# EAGLE design test_platform (EAGLE 6.5.0)
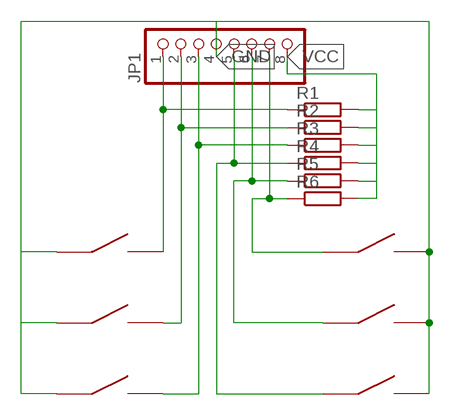
[diagram p0: schematic, sheet 1]

## Parts
JP1  PINHD-1X8BIG  [1X08-BIG]
R1  R-EU_M0805  [M0805]
R2  R-EU_M0805  [M0805]
R3  R-EU_M0805  [M0805]
R4  R-EU_M0805  [M0805]
R5  R-EU_M0805  [M0805]
R6  R-EU_M0805  [M0805]
U$1  SMT_BUTTON  [SMT-BUTTON]
U$2  SMT_BUTTON  [SMT-BUTTON]
U$3  SMT_BUTTON  [SMT-BUTTON]
U$4  SMT_BUTTON  [SMT-BUTTON]
U$5  SMT_BUTTON  [SMT-BUTTON]
U$6  SMT_BUTTON  [SMT-BUTTON]

## Nets
GND: JP1.4 U$1.A1(A) U$1.A2(A) U$2.A1(A) U$2.A2(A) U$3.A1(A) U$3.A2(A) U$4.B1(B) U$4.B2(B) U$5.B1(B) U$5.B2(B) U$6.B1(B) U$6.B2(B)
N$1: JP1.1 R1.1 U$1.B1(B) U$1.B2(B)
N$2: JP1.2 R2.1 U$2.B1(B) U$2.B2(B)
N$3: JP1.3 R3.1 U$3.B1(B) U$3.B2(B)
N$4: JP1.5 R4.1 U$4.A1(A) U$4.A2(A)
N$5: JP1.6 R5.1 U$5.A1(A) U$5.A2(A)
N$6: JP1.7 R6.1 U$6.A1(A) U$6.A2(A)
VCC: JP1.8 R1.2 R2.2 R3.2 R4.2 R5.2 R6.2

## Library data of the parts
JP1 = adafruit:PINHD-1X8: PIN HEADER
R1-R6 = rcl:R-EU_: RESISTOR, European symbol
U$1-U$6 = BraillePad:SMT_BUTTON

## Board
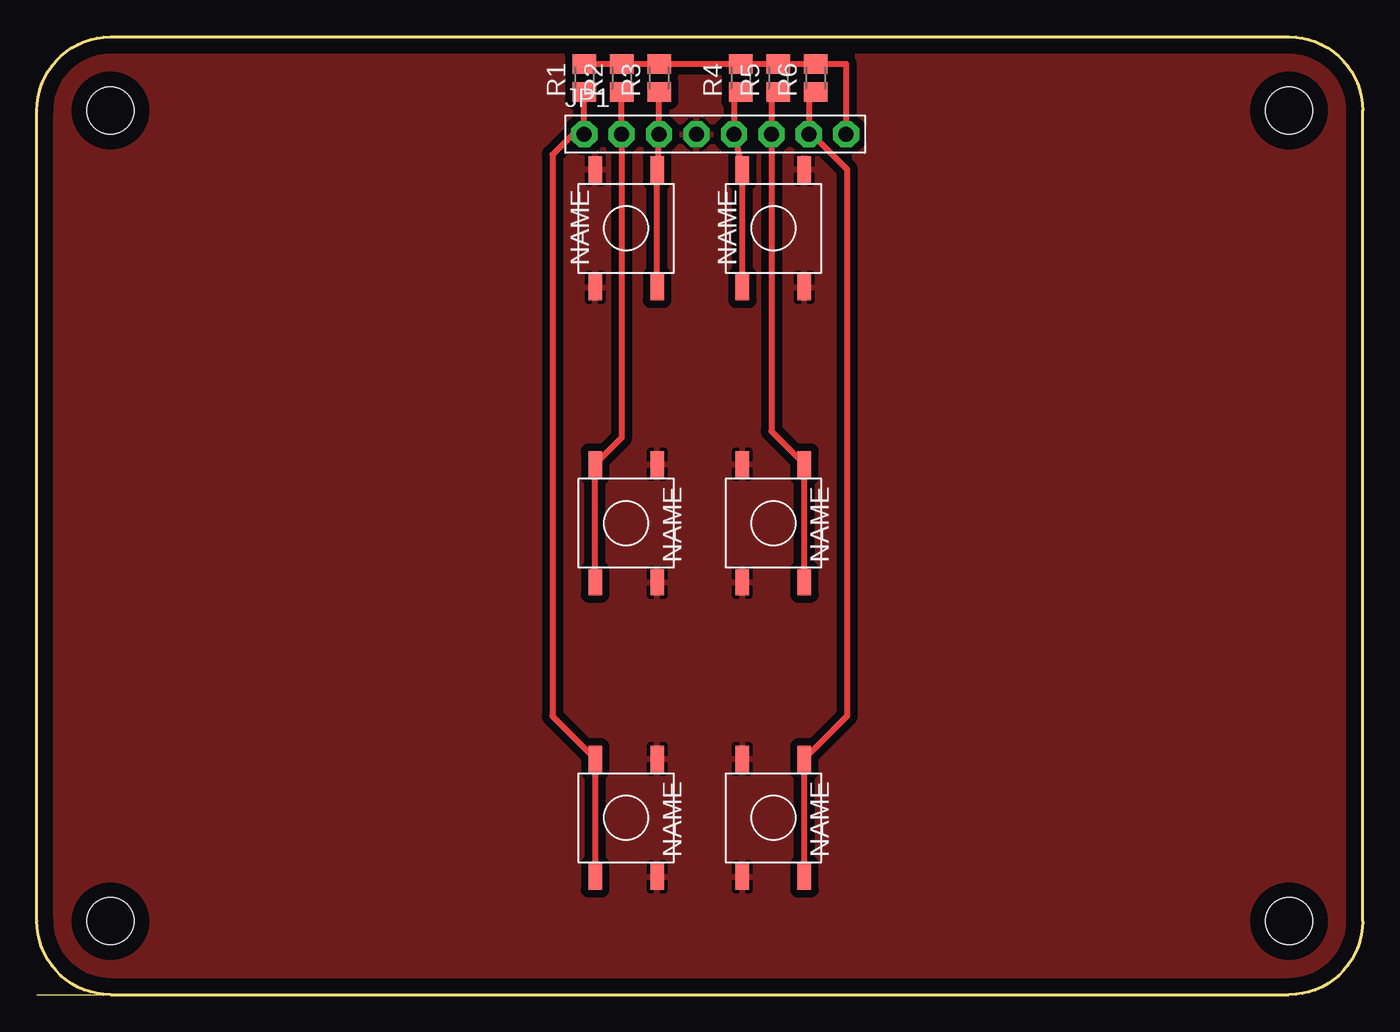
[diagram p1: board, top side]

Size 90 x 65 mm. Coordinates in mm from the lower left corner, seen from the top.
Outline: 0,0 5,0
Outline: 5,0 85,0 arc90 90,5 90,60 arc90 85,65 5,65 arc90 0,60 0,5 arc90 5,0
Copper layers (1*16): Top 0.035mm / dielectric 1.5mm / Bottom 0.035mm
Design rules "default *": minimum track width 10mil, minimum drill 24mil, track to track 20mil, track to pad 20mil, pad to pad 20mil, via to via 20mil, smd to smd 20mil, copper to edge 40mil, drill to drill 8mil, minimum pad ring 10mil, minimum via ring 8mil, stop-mask expansion 4mil, vias tented up to drill 0mil, thermal gap 10mil
Holes 3.2 mm at 5,5 85,5 85,60 5,60

### Footprints (pad centres in the part's own frame; a part is rotated, then mirrored left to right if it is on the bottom)
1X08-BIG = drill 1.016 pad 1.778 octagon: 1 -8.89,0; 2 -6.35,0; 3 -3.81,0; 4 -1.27,0; 5 1.27,0; 6 3.81,0; 7 6.35,0; 8 8.89,0
M0805 = smd 1.3 x 1.6: 1 -0.95,0; 2 0.95,0
SMT-BUTTON = smd 0.914 x 1.778: A1 -2.1,4; A2 -2.1,-4; B1 2.1,4; B2 2.1,-4

### Placement (x,y rotation side)
JP1  46.05,58.4 0 top
R1  37.16,62.21 90 top
R2  39.7,62.21 90 top
R3  42.24,62.21 90 top
R4  47.78,62.21 90 top
R5  50.32,62.21 90 top
R6  52.86,62.21 90 top
U$1  40,12 180 top
U$2  40,32 180 top
U$3  40,52 0 top
U$4  50,52 0 top
U$5  50,32 180 top
U$6  50,12 180 top

### Tracks (layer width: path | path; a pad name or v marks a point on that pad's centre or on a via)
GND
  pour Top: 0,65 0,0 90,0 90,65
N$1
  Top 0.406: R1.1 JP1.1 36.4,58.4 35,57 35,18.9 U$1.B2 U$1.B1
N$2
  Top 0.406: R2.1 JP1.2 39.7,37.8 U$2.B2 U$2.B1
N$3
  Top 0.406: R3.1 JP1.3 U$3.B1 U$3.B2
N$4
  Top 0.406: R4.1 47.32,61.26 JP1.5 U$4.A1 U$4.A2
N$5
  Top 0.406: R5.1 49.86,61.26 JP1.6 49.86,38.24 U$5.A2 U$5.A1
N$6
  Top 0.406: R6.1 52.4,61.26 JP1.7 52.6,58.4 55,56 55,18.9 U$6.A2 U$6.A1
VCC
  Top 0.406: R6.2 52.4,63.16 | R1.2 R2.2 R3.2 R4.2 R5.2 R6.2 | R6.2 54.94,63.16 JP1.8